# EAGLE design Wisp v03 (EAGLE 6.5.0)
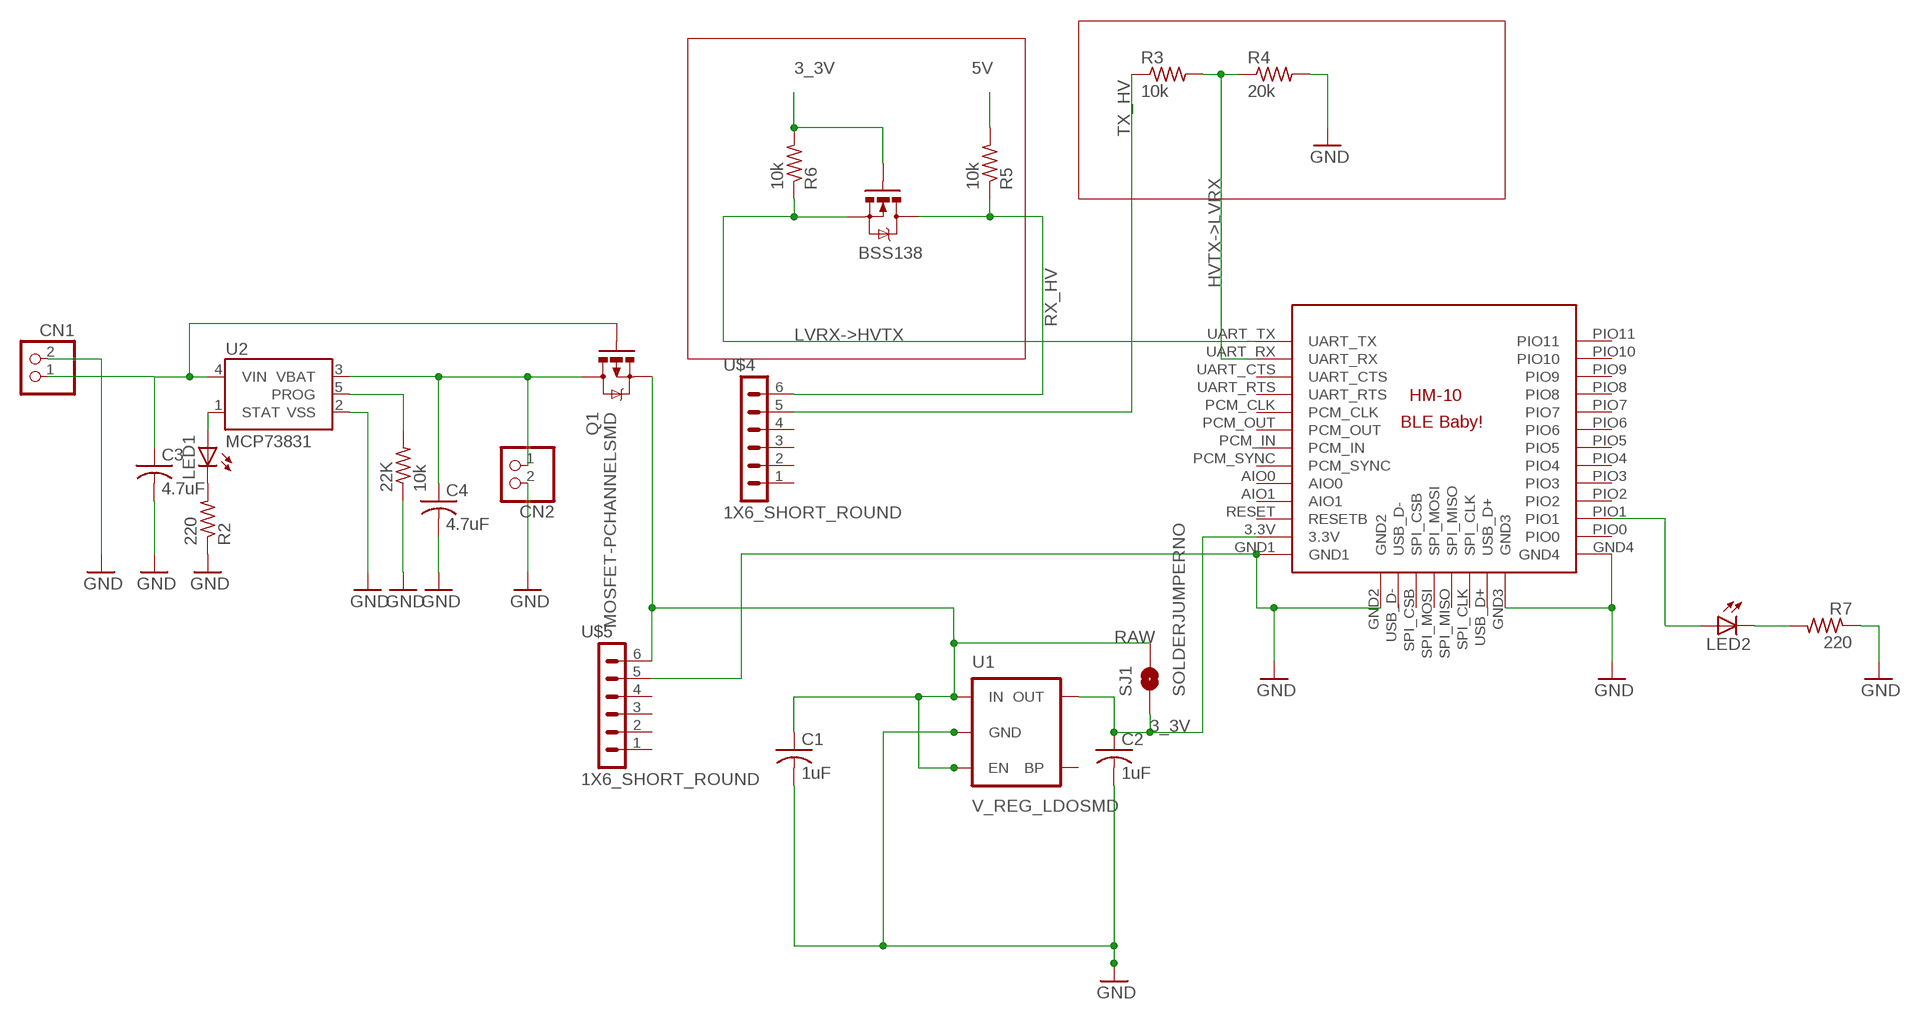
[diagram p0: schematic, sheet 1]

## Parts
22K  10k  R-US_R0402  [R0402]
BSS138  MOSFET-NCHANNELSMD  [SOT23-3]
C1  1uF  C-USC0805K  [C0805K]
C2  1uF  C-USC0805K  [C0805K]
C3  4.7uF  C-USC0805K  [C0805K]
C4  4.7uF  C-USC0805K  [C0805K]
CN1  JST_2PIN-THM  [JST-PH-2-THM]
CN2  JST_2PIN-THM  [JST-PH-2-THM]
LED1  LED0603  [LED-0603]
LED2  LED0603  [LED-0603]
Q1  MOSFET-PCHANNELSMD  [SOT23-3]
R2  220  R-US_R0402  [R0402]
R3  10k  R-US_R0402  [R0402]
R4  20k  R-US_R0402  [R0402]
R5  10k  R-US_R0402  [R0402]
R6  10k  R-US_R0402  [R0402]
R7  220  R-US_R0402  [R0402]
SJ1  SOLDERJUMPERNO  [SJ_2S-NO]
U1  V_REG_LDOSMD  [SOT23-5]
U2  MCP73831  [SOT23-5]
U$1  BLE-HM-10  [BLE-HM-10]
U$4  1X6_SHORT_ROUND  [1X6_SHORT_ROUND]
U$5  1X6_SHORT_ROUND  [1X6_SHORT_ROUND]

## Nets
3_3V: BSS138.1(G) C2.1 R6.2 SJ1.1 U1.5(OUT) U$1.3.3V
5V: R5.2
BAT_RAW: C3.1 CN1.1 Q1.1(G) U2.4(VIN)
GND: 22K.1 C1.2 C2.2 C3.2 C4.2 CN1.2 CN2.2 R2.1 R4.2 R7.1 U1.2(GND) U2.2(VSS) U$1.GND1 U$1.GND2 U$1.GND3 U$1.GND4 U$5.5
HVTX->LVRX: R3.2 R4.1 U$1.UART_RX
LVRX->HVTX: BSS138.2(S) R6.1 U$1.UART_TX
N$1: LED1.A U2.1(STAT)
N$2: LED2.A U$1.PIO1
N$3: LED1.C R2.2
N$4: 22K.2 U2.5(PROG)
N$26: LED2.C R7.2
RAW: C1.1 Q1.2(S) SJ1.2 U1.1(IN) U1.3(EN) U$5.6
RX_HV: BSS138.3(D) R5.1 U$4.6
TX_HV: R3.1 U$4.5
VBAT_BUS: C4.1 CN2.1 Q1.3(D) U2.3(VBAT)
Unconnected: U1.4(BP) U$1.AIO0 U$1.AIO1 U$1.PCM_CLK U$1.PCM_IN U$1.PCM_OUT U$1.PCM_SYNC U$1.PIO0 U$1.PIO2 U$1.PIO3 U$1.PIO4 U$1.PIO5 U$1.PIO6 U$1.PIO7 U$1.PIO8 U$1.PIO9 U$1.PIO10 U$1.PIO11 U$1.RESET(RESETB) U$1.SPI_CLK U$1.SPI_CSB U$1.SPI_MISO U$1.SPI_MOSI U$1.UART_CTS U$1.UART_RTS U$1.USB_D+ U$1.USB_D- U$4.1 U$4.2 U$4.3 U$4.4 U$5.1 U$5.2 U$5.3 U$5.4

## Library data of the parts
22K R2-R7 = resistor:R-US_: RESISTOR, American symbol
BSS138 = SparkFun:MOSFET-NCHANNEL
C1-C4 = resistor:C-US: CAPACITOR, American symbol
CN1 CN2 = adafruit:JST_2PIN: JST 2-Pin Connectors of various flavors SMT-RA (S2B-PH-SM4) 4UConnector #17311 SMT (B2B-PH-SM4) THM-RA (S2B-PH) THM (B2B-PH)
LED1 LED2 = SparkFun:LED: LEDs Standard schematic elements and footprints for 5mm, 3mm, 1206, and 0603 sized LEDs. 5mm - Spark Fun Electronics SKU : COM-00529 (and others)
Q1 = SparkFun-DiscreteSemi:MOSFET-PCHANNEL: Generic PMOSFET
SJ1 = SparkFun:SOLDERJUMPER: Solder Jumper Standard SMD solder jumper. Used to automate production. Two varients : Normally Open and Normally Closed are the same, but have different paste layers. NC will have a large amount of paste and should jumper during reflow.
U1 = SparkFun:V_REG_LDO: Voltage Regulator LDO Standard 150mA LDO voltage regulator in SOT-23 layout. Micrel part MIC5205. BP (by-pass) pin is used to lower output noise with 470pF cap.
U2 = SparkFun-PowerIC:MCP73831: Miniature single cell, fully integrated Li-Ion, Li-polymer charge management controller http://ww1.microchip.com/downloads/en/DeviceDoc/21984a.pdf IC-09995; PROD_ID: IC-09995
U$1 = Random parts:BLE-HM-10
U$4 U$5 = Random parts(01-14-14):1X6_SHORT_ROUND

## Board
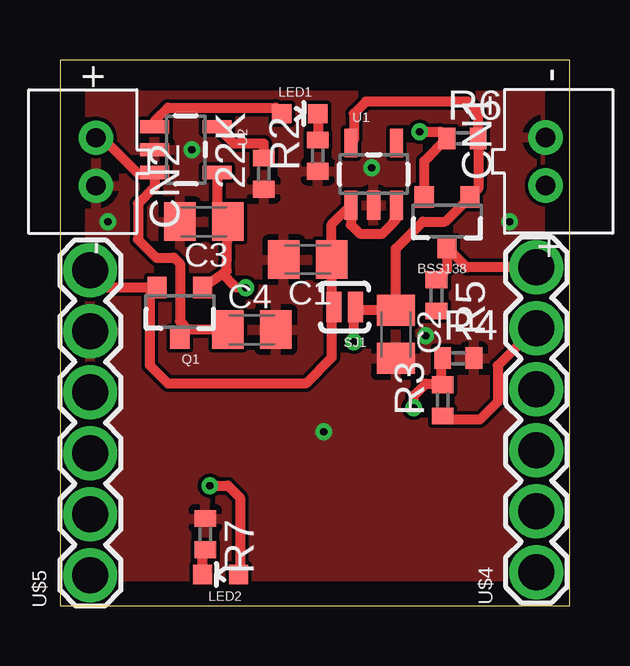
[diagram p1: board, top side]
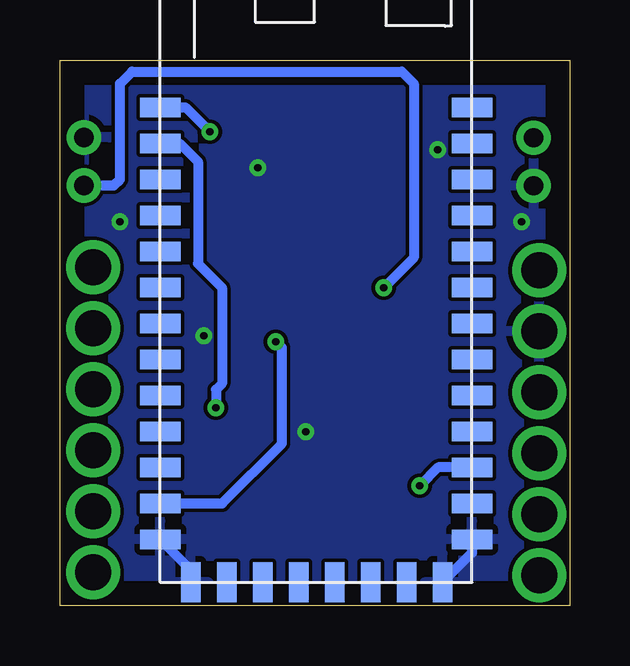
[diagram p2: board, bottom side, seen from below]

Size 21.25 x 22.73 mm. Coordinates in mm from the lower left corner, seen from the top.
Outline: 0,22.73 0,0 21.25,0 21.25,22.73 0,22.73
Copper layers (1*16): Top 0.035mm / dielectric 1.5mm / Bottom 0.035mm
Design rules "default *": minimum track width 10mil, minimum drill 24mil, track to track 6mil, track to pad 6mil, pad to pad 6mil, via to via 6mil, smd to smd 6mil, copper to edge 40mil, drill to drill 8mil, minimum pad ring 10mil, minimum via ring 8mil, stop-mask expansion 4mil, vias tented up to drill 0mil, thermal gap 10mil

### Footprints (pad centres in the part's own frame; a part is rotated, then mirrored left to right if it is on the bottom)
R0402 = smd 0.7 x 0.9: 1 -0.65,0; 2 0.65,0
SOT23-3 = smd 0.8 x 0.9: 1 -0.95,-1; 2 0.95,-1; 3 0,1.1
C0805K = smd 1.3 x 1.6: 1 -1,0; 2 1,0
JST-PH-2-THM = drill 0.8 pad 1.422: 1 1,0; 2 -1,0
LED-0603 = smd 0.8 x 0.8: A 0,-0.75; C 0,0.75
SJ_2S-NO = smd 0.635 x 1.27: 1 -0.45,0; 2 0.45,0
SOT23-5 = smd 0.55 x 1.2: 1 -0.95,-1.3; 2 0,-1.3; 3 0.95,-1.3; 4 0.95,1.3; 5 -0.95,1.3
BLE-HM-10 = smd 1.676 x 0.813: 3.3V 0,3.29; AIO0 0,7.79; AIO1 0,6.29; GND1 0,1.79; GND4 13,1.79; PCM_CLK 0,13.79; PCM_IN 0,10.79; PCM_OUT 0,12.29; PCM_SYNC 0,9.29; PIO0 13,3.29; PIO1 13,4.79; PIO2 13,6.29; PIO3 13,7.79; PIO4 13,9.29; PIO5 13,10.79; PIO6 13,12.29; PIO7 13,13.79; PIO8 13,15.29; PIO9 13,16.79; PIO10 13,18.29; PIO11 13,19.79; RESET 0,4.79; UART_CTS 0,16.79; UART_RTS 0,15.29; UART_RX 0,18.29; UART_TX 0,19.79 | smd 0.813 x 1.676: GND2 1.27,0; GND3 11.77,0; SPI_CLK 8.77,0; SPI_CSB 4.27,0; SPI_MISO 7.27,0; SPI_MOSI 5.77,0; USB_D+ 10.27,0; USB_D- 2.77,0
1X6_SHORT_ROUND = drill 1.5 pad 2.2: 1 1.27,-1.27; 2 3.81,-1.27; 3 6.35,-1.27; 4 8.89,-1.27; 5 11.43,-1.27; 6 13.97,-1.27

### Placement (x,y rotation side)
22K  8.5,18 90 top
BSS138  16.14,16.02 180 top
C1  10.33,14.42 180 top
C2  14.01,11.3 270 top
C3  6,16 180 top
C4  8,11.5 0 top
CN1  20.25,18.51 270 top
CN2  1.5,18.5 90 top
LED1  10,20.5 270 top
LED2  6.7,1.29 90 top
Q1  5,12.25 180 top
R2  10.75,18.75 90 top
R3  15.95,8.55 90 top
R4  16.61,10.31 0 top
R5  15.7,12.93 270 top
R6  16.79,19.47 0 top
R7  6.06,2.98 270 top
SJ1  11.88,12.44 180 top
U1  13.08,17.98 0 top
U2  5.25,19 270 top
U$1  17.06,0.97 0 bottom
U$4  18.6,0.12 90 top
U$5  0,0 90 top

### Tracks (layer width: path | path; a pad name or v marks a point on that pad's centre or on a via)
3_3V  (via drill 0.3)
  Top 0.406: U1.5 12.25,19.4 12.25,20.5 12.75,21 17,21 17.44,20.56 R6.2 17.44,17.37 BSS138.1 16.06,16 15.13,16 14.01,14.88 C2.1 12.46,12.3 SJ1.1 12.25,12.37 v12.25,11
  Bottom 0.406: U$1.3.3V 14.49,4.26 12,6.75 12,10.75 v12.25,11
BAT_RAW  (via drill 0.3)
  Top 0.406: Q1.1 6.77,13.83 | 6.77,13.83 6.95,13.95 6.99,15.51 | 6.99,15.51 C3.1 | U2.4 6.55,15.94 6.99,15.51 | v7.75,13.25 7.35,13.25 6.77,13.83
  Bottom 0.406: CN1.1 18.99,17.51 18.75,17.75 18.75,21.75 18.25,22.25 7,22.25 6.5,21.75 6.5,14.5 v7.75,13.25
GND  (via drill 0.3)
  Bottom 0.406: U$1.GND4 4.06,2.2 U$1.GND3 | U$1.GND2 15.79,1.49 U$1.GND1
  other vias: 11,7.25 2,16 5.5,19 13,18.25 18.75,16 15.25,11.25
  pour Bottom: 0,21.5 0,-0.5 21.75,-0.5 22,-0.5 22,21.5
  pour Top: 0,21.25 0,-0.75 21.75,-0.75 22,-0.75 22,21.25
HVTX->LVRX  (via drill 0.3)
  Top 0.406: v14.75,8.25 14.75,8.75 15.25,9.25 15.91,9.25 | 15.91,9.25 R3.2 | 15.91,9.25 15.91,10.26 R4.1
  Bottom 0.406: U$1.UART_RX 16.26,19.26 15.5,18.5 15.5,14.25 14.5,13.25 14.5,9.25 14.75,9 v14.75,8.25
LVRX->HVTX  (via drill 0.3)
  Top 0.406: BSS138.2 15.19,18.52 R6.1 15.86,19.75 v15,19.75
  Bottom 0.406: U$1.UART_TX 16.01,20.76 v15,19.75
N$1
  Top 0.406: U2.1 3.95,20.2 4.5,20.75 9,20.75 LED1.A
N$2  (via drill 0.3)
  Top 0.406: v6.25,5 7,5 7.5,4.5 7.5,1.34 LED2.A
  Bottom 0.406: U$1.PIO1 5.49,5.76 v6.25,5
N$3
  Top 0.406: LED1.C R2.2
N$4
  Top 0.406: 22K.2 8.5,19.25 7.25,19.25 U2.5
N$26
  Top 0.406: LED2.C 5.95,2.22 R7.2
RAW
  Top 0.406: 11.33,12.54 C1.1 11.33,15.88 U1.1 12.13,15.87 12.5,15.5 13.45,15.5 13.9,15.95 13.9,15.98 14.03,16.11 U1.3 | 11.33,12.54 SJ1.2 | 11.33,12.54 11.33,10.33 10.25,9.25 4.5,9.25 3.75,10 3.75,12.95 Q1.2 1.99,13.25 U$5.6
RX_HV
  Top 0.406: U$4.6 16.97,14.1 BSS138.3 16.14,14.02 R5.1
TX_HV
  Top 0.406: U$4.5 19.8,11.55 18.25,10 18.25,8.5 17.5,7.75 16.11,7.75 R3.1
VBAT_BUS
  Top 0.406: C4.1 5.35,11.5 | 5.35,11.5 Q1.3 | CN2.1 1.75,19.5 3.25,18 3.9,18 U2.3 3.95,17.45 3.25,16.75 3.25,15.25 4,14.5 4.75,14.5 5,14.25 5,11.85 5.35,11.5